# Altium project echOpen_ADC_Card.PrjPcb
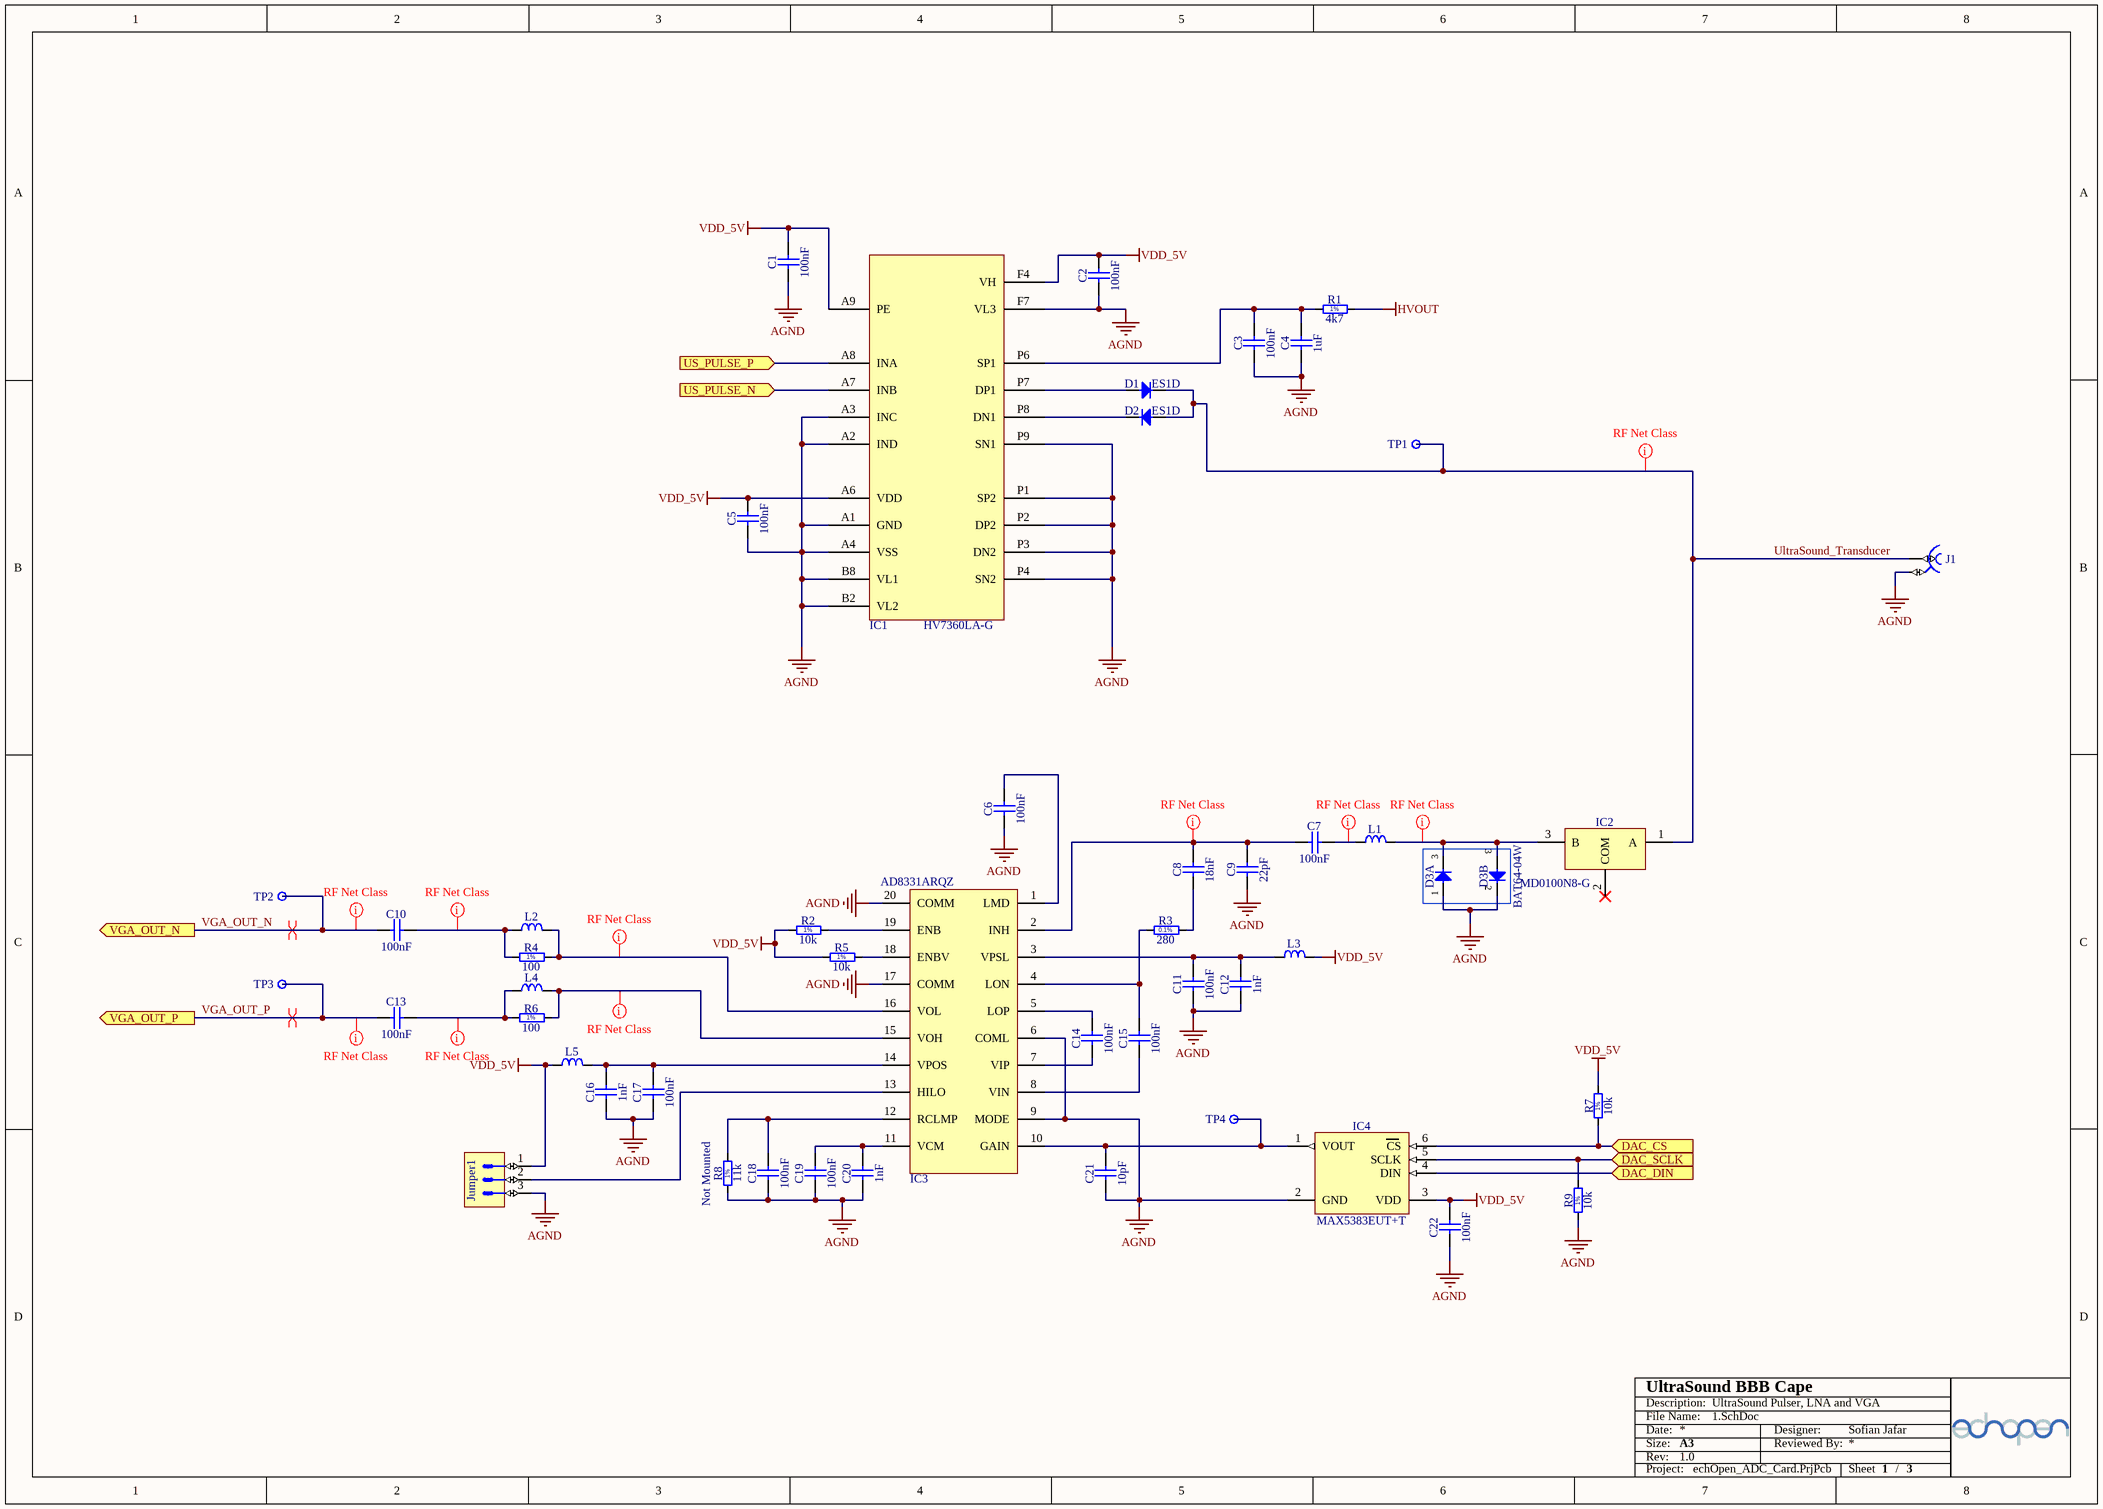
[diagram p0: 1.SchDoc]
GlobalProjectContactEmail: murgen@echopen.org; GlobalProjectDesigner: S. Jafar; GlobalProjectLink: www.echOpen.com; GlobalProjectName: MURGEN; GlobalProjectRevision: 1.0
1 sheet, 49 parts. Net scope: flat (ports and power ports of the same name join across sheets).
Board file: echOpen_ADC_Card.PcbDoc

## Sheet 1.SchDoc
size A3; Author: Sofian Jafar; Engineer: Sofian Jafar; DocumentNumber: 1; Revision: 1.0; SheetNumber: 1; SheetTotal: 3; Descripition: UltraSound BBB Cape; SheetDescription: UltraSound Pulser, LNA and VGA

### Parts
C1  100nF  [CAPC1608X87N]
C2  100nF  [CAPC1608X87N]
C3  100nF  [CAPC1608X87N]
C4  1uF  [CAPC5650X165N]
C5  100nF  [CAPC1608X87N]
C6  100nF  [CAPC1608X87N]
C7  100nF  [CAPC1608X87N]
C8  18nF  [CAPC1608X87N]
C9  22pF  [CAPC1608X87N]
C10  100nF  [CAPC1608X87N]
C11  100nF  [CAPC1608X87N]
C12  1nF  [CAPC1608X87N]
C13  100nF  [CAPC1608X87N]
C14  100nF  [CAPC1608X87N]
C15  100nF  [CAPC1608X87N]
C16  1nF  [CAPC1608X87N]
C17  100nF  [CAPC1608X87N]
C18  100nF  [CAPC1608X87N]
C19  100nF  [CAPC1608X87N]
C20  1nF  [CAPC1608X87N]
C21  10pF  [CAPC1608X87N]
C22  100nF  [CAPC1608X87N]
D1  ES1D  [DIOM5027X244N]
D2  ES1D  [DIOM5027X244N]
D3  BAT64-04W  [SOT65P210X100-3N]  (parts A,B of 2)
IC1  HV7360LA-G  [HV7360]
IC2  MD0100N8-G  [SOT89]
IC3  AD8331ARQZ  [SOP64P600X175-20N]
IC4  MAX5383EUT+T  [SOT95P280X100-6N]
J1  SMA  [AMPHENOL_132357-11]  (value not drawn)
Jumper1  (no value)  [SULLINS_GRPB031VWVN]
L1  75R@100MHz  [INDC2012X105N]  (value not drawn)
L2  75R@100MHz  [INDC2012X105N]  (value not drawn)
L3  75R@100MHz  [INDC2012X105N]  (value not drawn)
L4  75R@100MHz  [INDC2012X105N]  (value not drawn)
L5  75R@100MHz  [INDC2012X105N]  (value not drawn)
R1  4k7  [RESC3216X65N]
R2  10k  [RESC1608X55N]
R3  280  [RESC1608X55N]
R4  100  [RESC1608X55N]
R5  10k  [RESC1608X55N]
R6  100  [RESC1608X55N]
R7  10k  [RESC1608X55N]
R8  11k  Mounted: Not Mounted  [RESC1005X40N]
R9  10k  [RESC1608X55N]
TP1  Test Point  [NICOMATIC_C12000B]  (value not drawn)
TP2  Test Point  [NICOMATIC_C12000B]  (value not drawn)
TP3  Test Point  [NICOMATIC_C12000B]  (value not drawn)
TP4  Test Point  [NICOMATIC_C12000B]  (value not drawn)

### Ports
DAC_CS (in), DAC_DIN (in), DAC_SCLK (in), US_PULSE_N (in), US_PULSE_P (in), VGA_OUT_N (out), VGA_OUT_P (out)

### Nets
AGND: C1.1 C2.1 C3.1 C4.1 C5.1 C6.2 C9.1 C11.1 C12.1 C16.1 C17.2 C18.2 C19.2 C20.1 C21.1 C22.1 D3.1(A) D3.2(C) IC1.A1(GND) IC1.A2(IND) IC1.A3(INC) IC1.A4(VSS) IC1.B2(VL2) IC1.B8(VL1) IC1.F7(VL3) IC1.P1(SP2) IC1.P2(DP2) IC1.P3(DN2) IC1.P4(SN2) IC1.P9(SN1) IC3.6(COML) IC3.9(MODE) IC3.17(COMM) IC3.20(COMM) IC4.2(GND) J1.2 Jumper1.3 R8.1 R9.1
HVOUT: R1.2
VDD_5V: C1.2 C2.2 C5.2 C22.2 IC1.A6(VDD) IC1.A9(PE) IC1.F4(VH) IC4.3(VDD) Jumper1.1 L3.2 L5.1 R2.1 R5.1 R7.2
UltraSound_Transducer: D1.1(C) D2.2(A) IC2.1(A) J1.1 TP1.1
VGA_OUT_N: C10.2 TP2.1 ; port VGA_OUT_N
VGA_OUT_P: C13.2 TP3.1 ; port VGA_OUT_P
NetC3_2: C3.2 C4.2 IC1.P6(SP1) R1.1
NetC6_1: C6.1 IC3.1(LMD)
NetC7_1: C7.1 L1.1
NetC7_2: C7.2 C8.2 C9.2 IC3.2(INH)
NetC8_1: C8.1 R3.2
NetC10_1: C10.1 L2.1 R4.1
NetC11_2: C11.2 C12.2 IC3.3(VPSL) L3.1
NetC13_1: C13.1 L4.1 R6.1
NetC14_1: C14.1 IC3.5(LOP)
NetC14_2: C14.2 IC3.7(VIP)
NetC15_1: C15.1 IC3.4(LON) R3.1
NetC15_2: C15.2 IC3.8(VIN)
NetC16_2: C16.2 C17.1 IC3.14(VPOS) L5.2
NetC18_1: C18.1 IC3.12(RCLMP) R8.2
NetC19_1: C19.1 C20.2 IC3.11(VCM)
NetC21_2: C21.2 IC3.10(GAIN) IC4.1(VOUT) TP4.1
NetD1_2: D1.2(A) IC1.P7(DP1)
NetD2_1: D2.1(C) IC1.P8(DN1)
NetD3_3: D3.3(COMAC) IC2.3(B) L1.2
NetIC1_A7: IC1.A7(INB) ; port US_PULSE_N
NetIC1_A8: IC1.A8(INA) ; port US_PULSE_P
NetIC3_13: IC3.13(HILO) Jumper1.2
NetIC3_15: IC3.15(VOH) L4.2 R6.2
NetIC3_16: IC3.16(VOL) L2.2 R4.2
NetIC3_18: IC3.18(ENBV) R5.2
NetIC3_19: IC3.19(ENB) R2.2
NetIC4_4: IC4.4(DIN) ; port DAC_DIN
NetIC4_5: IC4.5(SCLK) R9.2 ; port DAC_SCLK
NetIC4_6: IC4.6(CS) R7.1 ; port DAC_CS

Not connected (* = marked no-connect by the designer): IC2 2(COM)*

### Layout directives
differential pair: VGA_OUT_N, VGA_OUT_P
net class RF: NetC7_1, NetC7_2, NetC10_1, NetC13_1, NetD3_3, NetIC3_15, NetIC3_16, UltraSound_Transducer, VGA_OUT_N, VGA_OUT_P

### Notes on the sheet
- File Name:
- Date:
- Rev:
- Description:
- Size:
- A3
- Designer:
- Reviewed By:
- Project:
- Sheet
- /
- (in symbol R0402_11K_1%_0.0625W_100PPM) 1%
- (in symbol R0603_10K_1%_0.1W_100PPM) 1%
- (in symbol R0603_100R_1%_0.1W_100PPM) 1%
- (in symbol R0603_280R_0.1%_0.063W_10PPM) 0.1%
- (in symbol R1206_4K7_1%_0.25W_100PPM) 1%

### Library data of the parts
C1-C3 C5-C7 C10 C11 C13-C15 C17-C19 C22 = CC0603_100NF_50V_10%_X7R: Non-polarised capacitor; Part Description: SMD Multilayer Chip Ceramic Capacitor; Manufacturer: GENERIC; Manufacturer1 Part Number: 223858615649; Voltage: 50V; TC: X7R; Tolerance: ±10%; Table: Capacitors SMD; Part Number: CC0603_100NF_50V_10%_X7R; Component Kind: Standard; Component Type: Standard; Pin Count: 2; Value: 100nF; Status: Preferred; Manufacturer Part Number: CC0603_100NF_50V_10%_X7R; Case: 0603; Mounted: Yes; Socket: No; SMD: Yes; Manufacturer1 Example: PHYCOMP; Manufacturer1 ComponentHeight: 0.87mm; HelpURL: \\cern.ch\dfs\Applications\Altium\Datasheets\CC0603_X7R_PHYCOMP.pdf; Author: CERN DEM JLC; CreateDate: 12/3/2007; LatestRevisionDate: 12/3/2007
C4 = CC2220_1UF_200V_10%_X7R: Non-polarised capacitor; Part Description: SMD Ceramic Chip Capacitor; Manufacturer: GENERIC; Manufacturer1 Part Number: C2220X105K2RAC; Voltage: 200V; TC: X7R; Tolerance: ±10%; Table: Capacitors SMD; Part Number: CC2220_1UF_200V_10%_X7R; Component Kind: Standard; Component Type: Standard; Pin Count: 2; Value: 1uF; Status: None; Manufacturer Part Number: CC2220_1UF_200V_10%_X7R; Case: 2220; Mounted: Yes; Socket: No; SMD: Yes; Manufacturer1 Example: KEMET; Manufacturer1 ComponentHeight: 1.65mm; HelpURL: \\cern.ch\dfs\Applications\Altium\Datasheets\CC2220_X7R_KEMET.pdf; Author: CERN DEM JLC; CreateDate: 9/16/2009; LatestRevisionDate: 9/16/2009
C8 = CC0603_18NF_50V_10%_X7R: Non-polarised capacitor; Part Description: SMD Multilayer Chip Ceramic Capacitor; Manufacturer: GENERIC; Manufacturer1 Part Number: 223858615639; Voltage: 50V; TC: X7R; Tolerance: ±10%; Table: Capacitors SMD; Part Number: CC0603_18NF_50V_10%_X7R; Component Kind: Standard; Component Type: Standard; Pin Count: 2; Value: 18nF; Status: Preferred; Manufacturer Part Number: CC0603_18NF_50V_10%_X7R; Case: 0603; Mounted: Yes; Socket: No; SMD: Yes; Manufacturer1 Example: PHYCOMP; Manufacturer1 ComponentHeight: 0.87mm; HelpURL: \\cern.ch\dfs\Applications\Altium\Datasheets\CC0603_X7R_PHYCOMP.pdf; Author: CERN DEM JLC; CreateDate: 12/3/2007; LatestRevisionDate: 12/3/2007
C9 = CC0603_22PF_50V_5%_NP0: Non-polarised capacitor; Part Description: SMD Multilayer Chip Ceramic Capacitor; Manufacturer: GENERIC; Manufacturer1 Part Number: 223886715229; Voltage: 50V; TC: NP0; Tolerance: ±5%; Table: Capacitors SMD; Part Number: CC0603_22PF_50V_5%_NP0; Component Kind: Standard; Component Type: Standard; Pin Count: 2; Value: 22pF; Status: Preferred; Manufacturer Part Number: CC0603_22PF_50V_5%_NP0; Case: 0603; Mounted: Yes; Socket: No; SMD: Yes; Manufacturer1 Example: PHYCOMP; Manufacturer1 ComponentHeight: 0.87mm; HelpURL: \\cern.ch\dfs\Applications\Altium\Datasheets\CC0603_NP0_PHYCOMP.pdf; Author: CERN DEM JLC; CreateDate: 12/3/2007; LatestRevisionDate: 12/3/2007
C12 C16 C20 = CC0603_1NF_50V_10%_X7R: Non-polarised capacitor; Part Description: SMD Multilayer Chip Ceramic Capacitor; Manufacturer: GENERIC; Manufacturer1 Part Number: 223858615623; Voltage: 50V; TC: X7R; Tolerance: ±10%; Table: Capacitors SMD; Part Number: CC0603_1NF_50V_10%_X7R; Component Kind: Standard; Component Type: Standard; Pin Count: 2; Value: 1nF; Status: Preferred; Manufacturer Part Number: CC0603_1NF_50V_10%_X7R; Case: 0603; Mounted: Yes; Socket: No; SMD: Yes; Manufacturer1 Example: PHYCOMP; Manufacturer1 ComponentHeight: 0.87mm; HelpURL: \\cern.ch\dfs\Applications\Altium\Datasheets\CC0603_X7R_PHYCOMP.pdf; Author: CERN DEM JLC; CreateDate: 12/3/2007; LatestRevisionDate: 12/3/2007
C21 = CC0603_10PF_50V_5%_NP0: Non-polarised capacitor; Part Description: SMD Multilayer Chip Ceramic Capacitor; Manufacturer: GENERIC; Manufacturer1 Part Number: 223886715109; Voltage: 50V; TC: NP0; Tolerance: ±5%; Table: Capacitors SMD; Part Number: CC0603_10PF_50V_5%_NP0; Component Kind: Standard; Component Type: Standard; Pin Count: 2; Value: 10pF; Status: Preferred; Manufacturer Part Number: CC0603_10PF_50V_5%_NP0; Case: 0603; Mounted: Yes; Socket: No; SMD: Yes; Manufacturer1 Example: PHYCOMP; Manufacturer1 ComponentHeight: 0.87mm; HelpURL: \\cern.ch\dfs\Applications\Altium\Datasheets\CC0603_NP0_PHYCOMP.pdf; Author: CERN DEM JLC; CreateDate: 12/3/2007; LatestRevisionDate: 12/3/2007
D1 D2 = ES1D: Diode; Part Description: Fast Rectifier; Manufacturer: FAIRCHILD SEMICONDUCTOR; Voltage: 200V; Power: 1A; Table: Diodes; Part Number: ES1D; Component Kind: Standard; Component Type: Standard; Device: ES1D; PackageDescription: DO-214-AC/SMA  Molded Diode, Body 5.0x2.7mm, IPC Medium Density; Manufacturer Part Number: ES1D; Pin Count: 2; Case: DO-214AC; Mounted: Yes; Socket: No; SMD: Yes; ComponentHeight: 2.44mm; HelpURL: \\cern.ch\dfs\Applications\Altium\Datasheets\ES1D.pdf; Author: CERN DEM JLC; CreateDate: 5/6/2008; LatestRevisionDate: 5/6/2008
D3 = BAT64-04W: Serial Diode; Part Description: Silicon Schottky Double Diode; Manufacturer: INFINEON; Voltage: 40V; Power: 250mW; Table: Diodes; Part Number: BAT64-04W; Component Kind: Standard; Component Type: Standard; Device: BAT64-04W; PackageDescription: SOT323, 0.65mm pitch; 3 pin, 1.25mm W X 2.00mm L, IPC Medium Density; Manufacturer Part Number: BAT64-04W; Pin Count: 3; Case: SOT323; Mounted: Yes; Socket: No; SMD: Yes; ComponentHeight: 1mm; HelpURL: \\cern.ch\dfs\Applications\Altium\Datasheets\BAT64-04W.pdf; Author: CERN DEM JMW; CreateDate: 1/8/2009; LatestRevisionDate: 1/8/2009
IC1 = HV7360LA-G: Part Description: High Speed, ±100V 2.5A Two or Three Level Ultrasound Pulser; Manufacturer: Supertex inc.; Table: Analog & Interface; Part Number: HV7360LA-G; Component Kind: Standard; Component Type: Standard; Device: HV7360LA-G; PackageDescription: High Speed, ±100V 2.5A Two or Three Level Ultrasound Pulser; Manufacturer Part Number: HV7360LA-G; Pin Count: 22; Case: LFGA-22; Mounted: Yes; Socket: No; SMD: Yes; ComponentHeight: 0.85; Author: S. Jafar; CreateDate: 12/20/2015; LatestRevisionDate: 1/6/2016
IC2 = MD0100N8-G: 3-Ultra-Sound HV Switch 1=A 2=COM 3=B; Manufacturer: Supertex inc.; Table: Analog & Interface; Part Number: MD0100N8-G; Component Kind: Standard; Component Type: Standard; Device: MD0100N8-G; PackageDescription: SOT89-3, 3-Leads, Body 2.44x4.5mm; Part Description: Ultra-Sound HV Switch; Manufacturer Part Number: MD0100N8-G; Pin Count: 4; Case: SOT89; Mounted: Yes; Socket: No; SMD: Yes; ComponentHeight: 1.6mm; Author: S. Jafar; CreateDate: 12/20/2015; LatestRevisionDate: 1/6/2016
IC3 = AD8331ARQZ: Part Description: Ultralow Noise VGAs with Preamplifier and Programmable RIN; Manufacturer: Analog Devices; Table: Analog & Interface; Part Number: AD8331ARQZ; Component Kind: Standard; Component Type: Standard; Device: AD8331ARQZ; PackageDescription: SOP, 20-Leads, Body 8.66x3.91mm, Pitch 0.64mm, IPC Medium Density; Manufacturer Part Number: AD8331ARQZ; Pin Count: 20; Case: QSOP-20; Mounted: Yes; Socket: No; SMD: Yes; ComponentHeight: 1.75mm; Author: S. Jafar; CreateDate: 12/20/2015; LatestRevisionDate: 1/6/2016
IC4 = MAX5383EUT+T: Low-Cost, Low-Power, 8-Bit DACs with 3-Wire  Serial Interface in SOT23; Manufacturer: MAXIM; Table: Analog & Interface; Part Number: MAX5383EUT+T; Component Kind: Standard; Component Type: Standard; Device: MAX5383EUT+T; PackageDescription: SOT23, 0.95mm pitch; 6 pin, 1.625mm W X 2.90mm L X 1.00mm H body, IPC Medium Density; Part Description: Low-Cost, Low-Power, 8-Bit DACs with 3-Wire  Serial Interface in SOT23; Manufacturer Part Number: MAX5383EUT+T; Pin Count: 6; Case: SOT363; Mounted: Yes; Socket: No; SMD: Yes; ComponentHeight: 1.0mm; Author: S. Jafar; CreateDate: 12/23/2015; LatestRevisionDate: 1/6/2016
J1 = AMPHENOL_132357-11: Part Description: SMA End Launch Jack for 1.58mm PCB, 50 Ohm, Flat Tab Contact; Part Number: AMPHENOL_132357-11; Component Kind: Standard; Component Type: Standard; Pin Count: 2; Family: SMA; Mounted: Yes; Socket: No; SMD: Yes; Status: None; Manufacturer: AMPHENOL; Manufacturer Part Number: 132357-11; ComponentHeight: 7.92mm; HelpURL: \\cern.ch\dfs\Applications\Altium\Datasheets\AMPHENOL_132357-11.pdf; Author: CERN DEM JLC; CreateDate: 5/14/2012; LatestRevisionDate: 5/14/2012; Table: AMPHENOL
Jumper1 = SULLINS_GRPB031VWVN: Connector 3 Male; Part Description: 3 Contact 0.5" Pitch Single-In-Line Vertical Header; Table: Miscellaneous; Part Number: SULLINS_GRPB031VWVN; Component Kind: Standard; Component Type: Standard; Pin Count: 3; Mounted: Yes; Socket: No; SMD: No; Status: None; Manufacturer: SULLINS; Manufacturer Part Number: GRPB031VWVN; ComponentHeight: 4mm; Author: S. Jafar; CreateDate: 12/29/2015; LatestRevisionDate: 12/29/2015
L1-L5 = IND0805_MURATA_BLM21BB750SN1D: Inductor; Part Description: SMD EMIFIL Suppression Chip Ferrite Bead; Manufacturer: MURATA; Power: 700mA; Resistance: 0.16R; Tolerance: ±25%; Table: Inductors SMD; Part Number: IND0805_MURATA_BLM21BB750SN1D; Component Kind: Standard; Component Type: Standard; Pin Count: 2; Value: 75R@100MHz; Status: None; Manufacturer Part Number: BLM21BB750SN1D; Case: 0805; Mounted: Yes; Socket: No; SMD: Yes; ComponentHeight: 1.05mm; Author: S. Jafar; CreateDate: 12/21/2015; LatestRevisionDate: 12/21/2015
R1 = R1206_4K7_1%_0.25W_100PPM: Resistor - 1%; Part Description: General Purpose Thick Film Chip Resistor; Manufacturer: GENERIC; Manufacturer1 Part Number: NRC12F4701TRF; Power: 0.25W; TC: ±100ppm/°C; Table: Resistors SMD; Part Number: R1206_4K7_1%_0.25W_100PPM; Component Kind: Standard; Component Type: Standard; Pin Count: 2; Value: 4k7; Status: Preferred; Tolerance: ±1%; Manufacturer Part Number: R1206_4K7_1%_0.25W_100PPM; Case: 1206; Mounted: Yes; Socket: No; SMD: Yes; Manufacturer1 Example: NIC COMPONENT; Manufacturer1 ComponentHeight: 0.65mm; HelpURL: \\cern.ch\dfs\Applications\Altium\Datasheets\R1206_NIC_NRC.pdf; Author: CERN DEM JLC; CreateDate: 12/3/2007; LatestRevisionDate: 3/13/2008
R2 R5 R7 R9 = R0603_10K_1%_0.1W_100PPM: Resistor - 1%; Part Description: General Purpose Thick Film Chip Resistor; Manufacturer: GENERIC; Manufacturer1 Part Number: NRC06F1002TRF; Power: 0.1W; TC: ±100ppm/°C; Table: Resistors SMD; Part Number: R0603_10K_1%_0.1W_100PPM; Component Kind: Standard; Component Type: Standard; Pin Count: 2; Value: 10k; Status: Preferred; Tolerance: ±1%; Manufacturer Part Number: R0603_10K_1%_0.1W_100PPM; Case: 0603; Mounted: Yes; Socket: No; SMD: Yes; Manufacturer1 Example: NIC COMPONENT; Manufacturer1 ComponentHeight: 0.55mm; HelpURL: \\cern.ch\dfs\Applications\Altium\Datasheets\R0603_NIC_NRC.pdf; Author: CERN DEM JLC; CreateDate: 12/3/2007; LatestRevisionDate: 3/13/2008
R3 = R0603_280R_0.1%_0.063W_10PPM: Resistor - 0.1%; Part Description: Thin Film Chip Resistor; Manufacturer: GENERIC; Manufacturer1 Part Number: RN73C1J280RBTDF; Power: 0.063W; TC: ±10ppm; Table: Resistors SMD; Part Number: R0603_280R_0.1%_0.063W_10PPM; Component Kind: Standard; Component Type: Standard; Pin Count: 2; Value: 280; Status: Not recommended; Tolerance: ±0.1%; Manufacturer Part Number: R0603_280R_0.1%_0.063W_10PPM; Case: 0603; Mounted: Yes; Socket: No; SMD: Yes; Manufacturer1 Example: TYCO HOLSWORTHY; Manufacturer1 ComponentHeight: 0.5mm; HelpURL: \\cern.ch\dfs\Applications\Altium\Datasheets\R0603_Tyco_RN73.pdf; Author: CERN DEM JLC; CreateDate: 12/3/2007; LatestRevisionDate: 3/13/2008
R4 R6 = R0603_100R_1%_0.1W_100PPM: Resistor - 1%; Part Description: General Purpose Thick Film Chip Resistor; Manufacturer: GENERIC; Manufacturer1 Part Number: NRC06F4700TRF; Power: 0.1W; TC: ±100ppm/°C; Table: Resistors SMD; Part Number: R0603_100R_1%_0.1W_100PPM; Component Kind: Standard; Component Type: Standard; Pin Count: 2; Value: 100; Status: Preferred; Tolerance: ±1%; Manufacturer Part Number: R0603_100R_1%_0.1W_100PPM; Case: 0603; Mounted: Yes; Socket: No; SMD: Yes; Manufacturer1 Example: NIC COMPONENT; Manufacturer1 ComponentHeight: 0.55mm; HelpURL: \\cern.ch\dfs\Applications\Altium\Datasheets\R0603_NIC_NRC.pdf; Author: CERN DEM JLC; CreateDate: 12/3/2007; LatestRevisionDate: 3/13/2008
R8 = R0402_11K_1%_0.0625W_100PPM: Resistor - 1%; Part Description: General Purpose Thick Film Chip Resistor; Manufacturer: GENERIC; Manufacturer1 Part Number: 232270671103L; TC: ±100ppm/°C; Table: Resistors SMD; Part Number: R0402_11K_1%_0.0625W_100PPM; Component Kind: Standard; Component Type: Standard; Pin Count: 2; Value: 11k; Status: Not recommended; Power: 0.0625W; Tolerance: ±1%; Manufacturer Part Number: R0402_11K_1%_0.0625W_100PPM; Case: 0402; Socket: No; SMD: Yes; Manufacturer1 Example: YAGEO PHYCOMP; Manufacturer1 ComponentHeight: 0.4mm; HelpURL: \\cern.ch\dfs\Applications\Altium\Datasheets\R0402_Phycomp_RC0402.pdf; Author: CERN DEM JLC; CreateDate: 12/3/2007; LatestRevisionDate: 10/17/2012
TP1-TP4 = NICOMATIC_C12000B: Part Description: SMD Test Point; Table: Miscellaneous; Part Number: NICOMATIC_C12000B; Component Kind: Standard; Component Type: Standard; Pin Count: 1; Family: Test Point; Mounted: Yes; Socket: No; SMD: Yes; Status: None; Manufacturer: NICOMATIC; Manufacturer Part Number: C12000B; ComponentHeight: 1.5mm; HelpURL: \\cern.ch\dfs\Applications\Altium\Datasheets\NICOMATIC_C12000B.pdf; Author: CERN DEM JLC; CreateDate: 3/25/2009; LatestRevisionDate: 3/25/2009